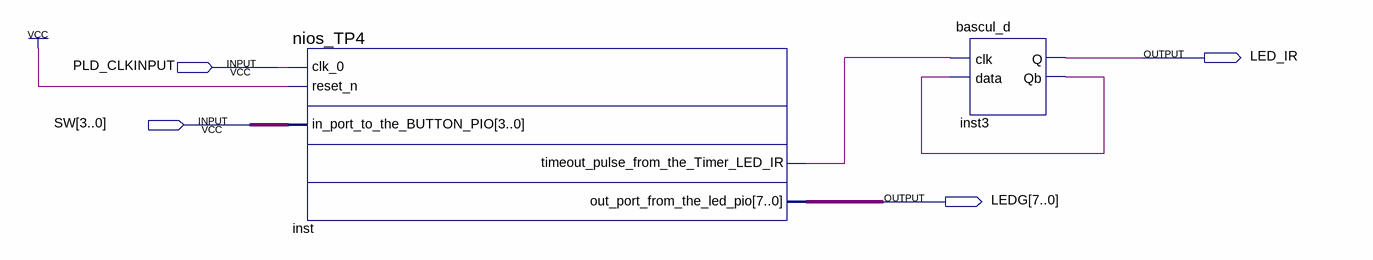
[diagram p0: schematic sheet]
// Quartus schematic block_TP4.bdf as structural Verilog: 2 symbols, 4 pins
module block_TP4 (
  input  PLD_CLKINPUT,
  input  [3:0] SW,
  output LED_IR,
  output [7:0] LEDG
);

  wire inst3_qb, inst_timeout_pulse_from_the_timer_led_ir;

  nios_TP4 inst (
    .clk_0(PLD_CLKINPUT), .reset_n(1'b1), .in_port_to_the_BUTTON_PIO(SW),
    .timeout_pulse_from_the_Timer_LED_IR(inst_timeout_pulse_from_the_timer_led_ir),
    .out_port_from_the_led_pio(LEDG));
  bascul_d inst3 (.clk(inst_timeout_pulse_from_the_timer_led_ir), .data(inst3_qb), .Q(LED_IR), .Qb(inst3_qb));
endmodule
